# EasyEDA schematic schematic_easyeda.json
TITLE: Sheet_1; REV: 1.0; Date: 2020-01-05; Sheet: 1/1; Drawn By: andre.nho; Company: Your Company
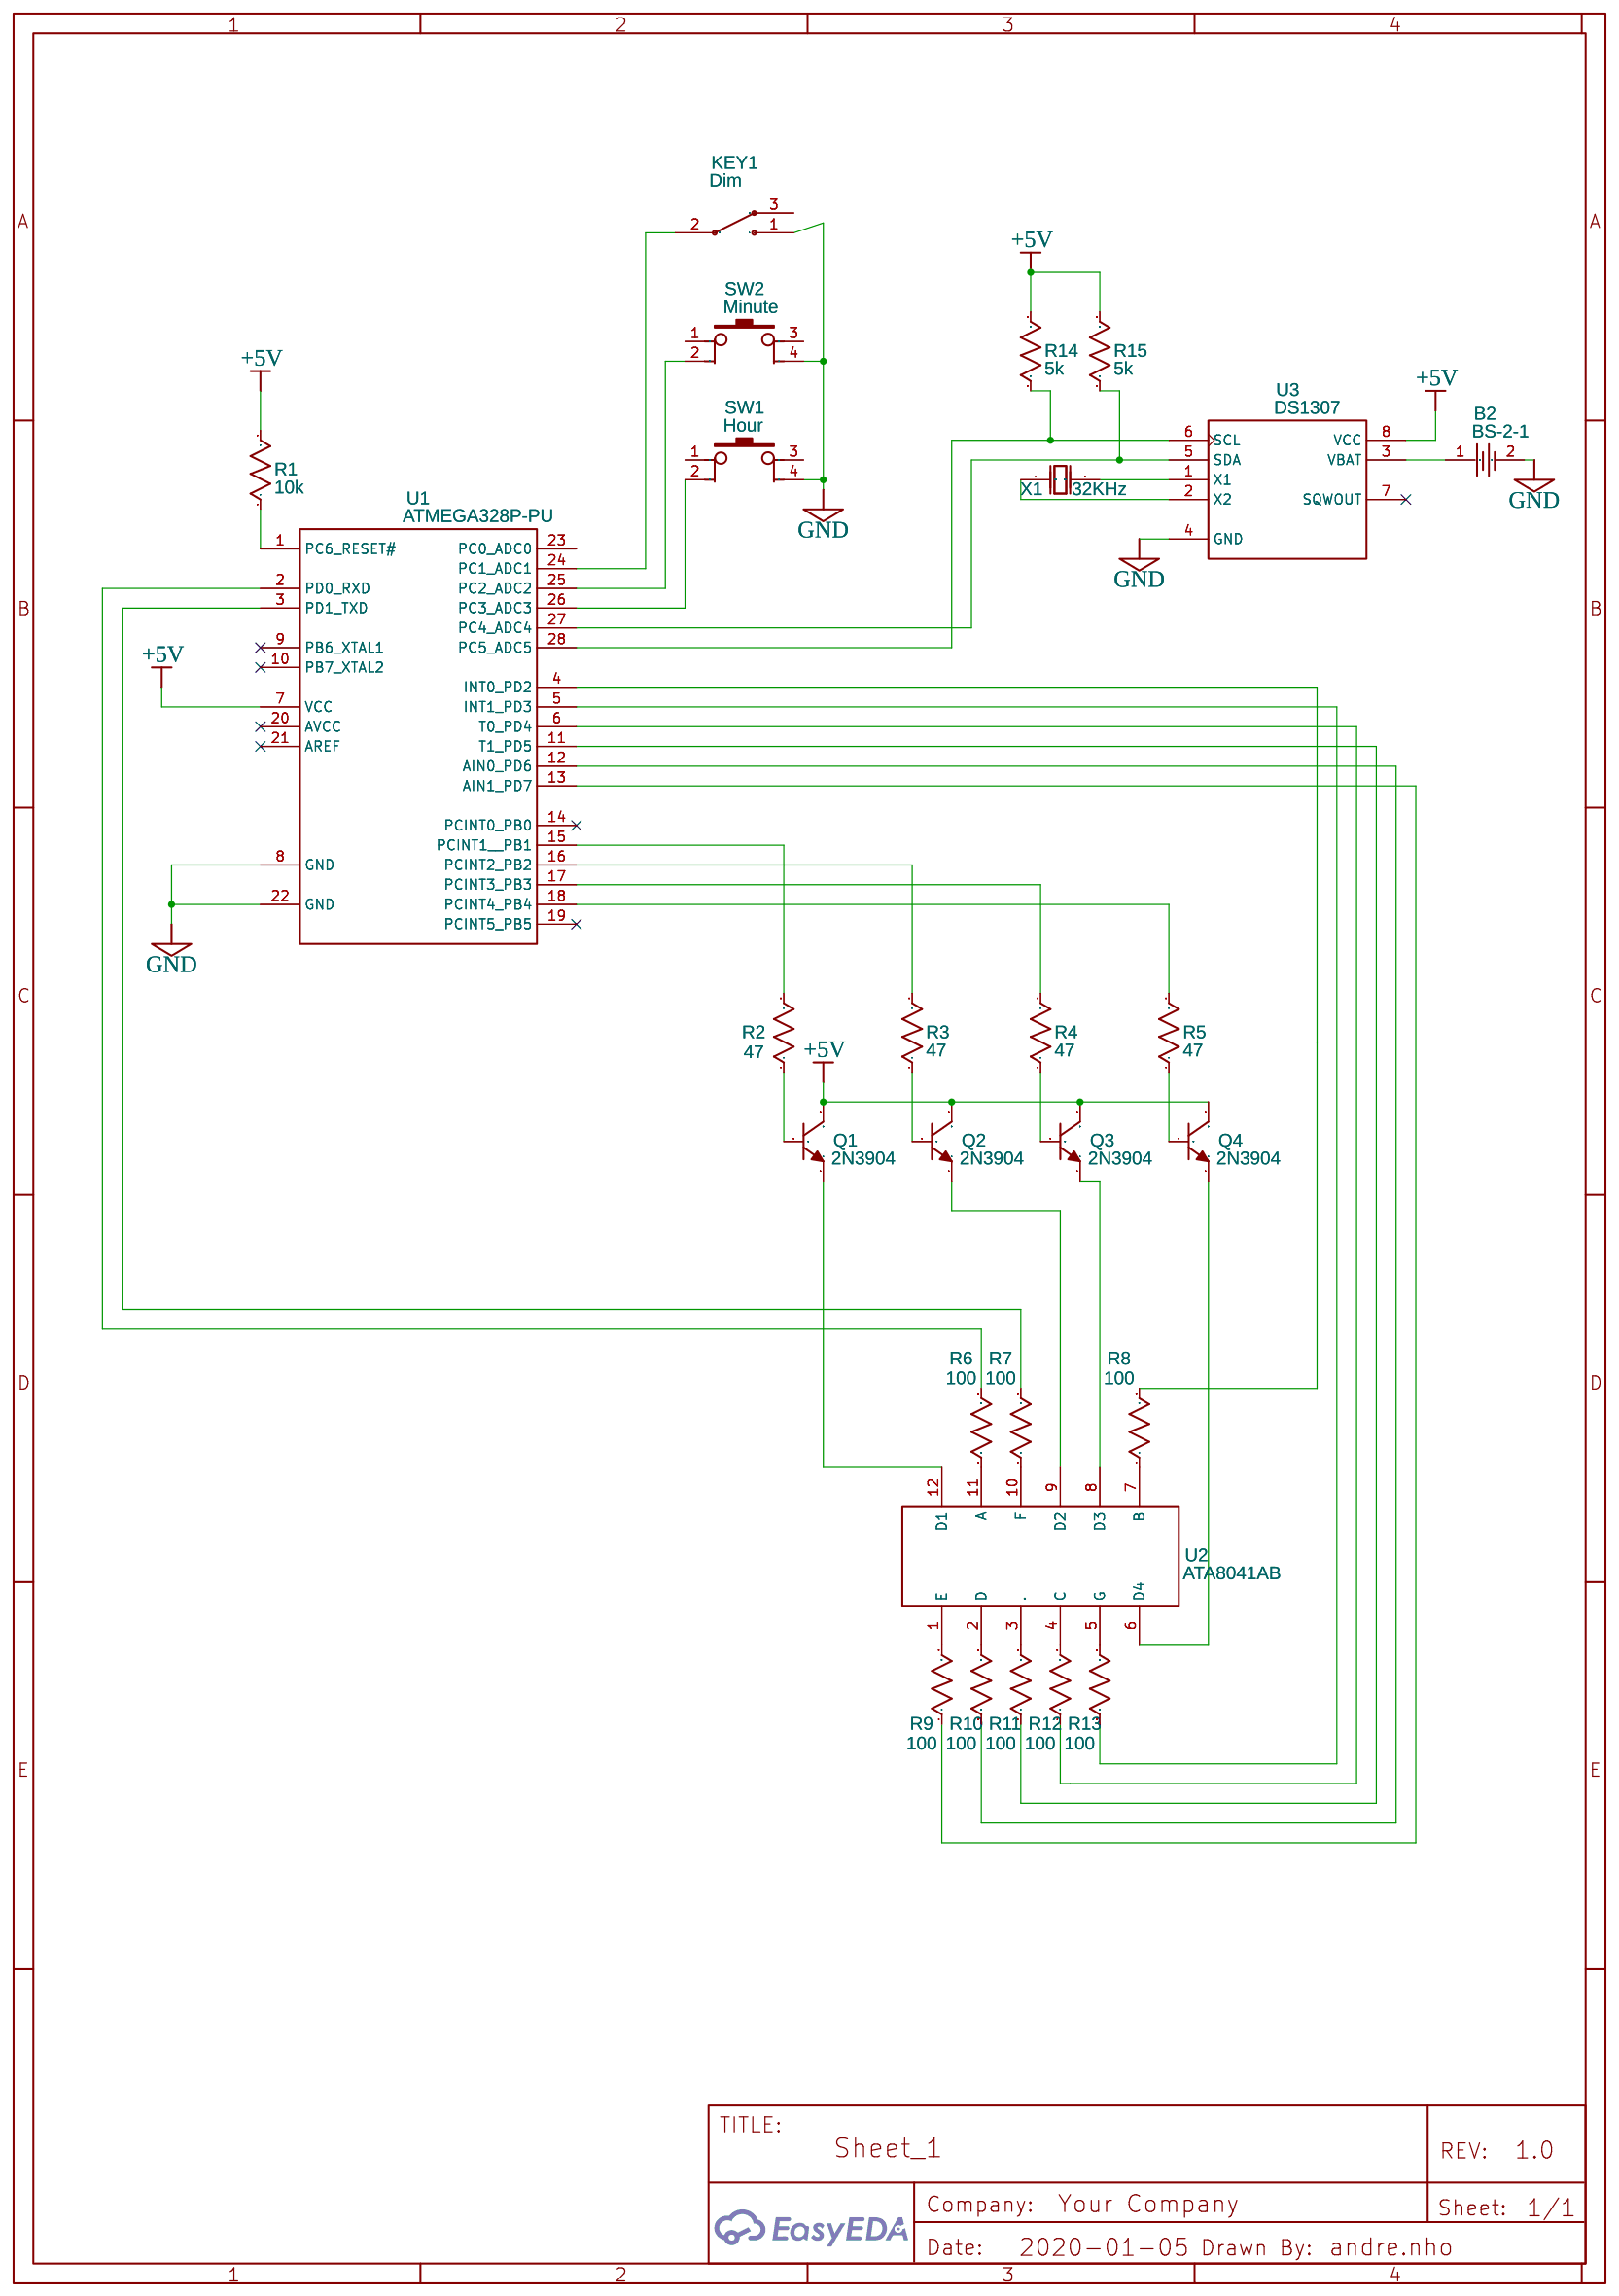
[diagram p0: schematic sheet]

## Parts
#1  -
B2  BS-2-1  [BAT-TH_BS-2-1]
KEY1  Dim  [MSK-11027]
Q1  2N3904  [TO-92(TO-92-3)]
Q2  2N3904  [TO-92(TO-92-3)]
Q3  2N3904  [TO-92(TO-92-3)]
Q4  2N3904  [TO-92(TO-92-3)]
R1  10k  [AXIAL-0.3]
R2  47  [AXIAL-0.3]
R3  47  [AXIAL-0.3]
R4  47  [AXIAL-0.3]
R5  47  [AXIAL-0.3]
R6  100  [AXIAL-0.3]
R7  100  [AXIAL-0.3]
R8  100  [AXIAL-0.3]
R9  100  [AXIAL-0.3]
R10  100  [AXIAL-0.3]
R11  100  [AXIAL-0.3]
R12  100  [AXIAL-0.3]
R13  100  [AXIAL-0.3]
R14  5k  [AXIAL-0.3]
R15  5k  [AXIAL-0.3]
SW1  Hour  [SW-SMD_4PIN-L6.00-W6.00]
SW2  Minute  [SW-SMD_4PIN-L6.00-W6.00]
U1  ATMEGA328P-PU  [DIP-28_L34.6-W7.3-P2.54-LS10.2-BL]
U2  ATA8041AB
U3  DS1307  [DIP-8]
X1  32KHz  [OSC-TH_BD2.1-P0.70-D0.3]

## Library data of the parts
#1 = -: BOM_Manufacturer Part: ?
B2 = BS-2-1: Supplier: LCSC; Manufacturer: Q&J; image: //image.lceda.cn/szlcsc/C70376.jpg; Supplier Part: C70376
KEY1 = MSK-11027 Toggle Switches: Supplier Part: C21381; Supplier: LCSC; Manufacturer: ReliaPro; image: http://image.lceda.cn/szlcsc/C21381.jpg
Q1-Q4 = 2N3904: Supplier: LCSC; Manufacturer: SEMTECH; Supplier Part: C118538
R1-R15 = Res_AXIAL-0.3(1/8W)_US
SW1 SW2 = Button-SMD-6×6×5mm: Supplier: LCSC; Manufacturer: ReliaPro; Manufacturer Part: 6×6×5mm RHOS; image: //image.lceda.cn/szlcsc/C21456.jpg; Supplier Part: C21456
U1 = ATMEGA328P-PU: sourceId: Oic6oiASL; Supplier: LCSC; Manufacturer: MICROCHIP; image: //image.lceda.cn/szlcsc/C33901.jpg; Contributor: LCSC; Supplier Part: C33901
U2 = ATA8041AB: Contributor: gregstarr2
U3 = DS1307: 64 X 8 Serial Real-Time Clock
X1 = CFV20632000AZFB: Supplier: LCSC; Supplier Part: C182052; Manufacturer: CITIZEN; Contributor: LCSC

## Nets
+5V: Q1.3(C) Q2.3(C) Q3.3(C) Q4.3(C) R1.2 R14.2 R15.2 U1.7(VCC) U3.8(VCC)
GND: B2.2 KEY1.1 SW1.4 SW2.4 U1.8(GND) U1.22(GND) U3.4(GND)
Net-(B2-1): B2.1 U3.3(VBAT)
Net-(KEY1-2): KEY1.2 U1.24(PC1 ADC1)
Net-(Q1-1): Q1.1(E) U2.12(D1)
Net-(Q1-2): Q1.2(B) R2.1
Net-(Q2-1): Q2.1(E) U2.9(D2)
Net-(Q2-2): Q2.2(B) R3.1
Net-(Q3-1): Q3.1(E) U2.8(D3)
Net-(Q3-2): Q3.2(B) R4.1
Net-(Q4-1): Q4.1(E) U2.6(D4)
Net-(Q4-2): Q4.2(B) R5.1
Net-(R1-1): R1.1 U1.1(PC6 RESET#)
Net-(R2-2): R2.2 U1.15(PCINT1  PB1)
Net-(R3-2): R3.2 U1.16(PCINT2 PB2)
Net-(R4-2): R4.2 U1.17(PCINT3 PB3)
Net-(R5-2): R5.2 U1.18(PCINT4 PB4)
Net-(R6-1): R6.1 U2.11(A)
Net-(R6-2): R6.2 U1.2(PD0 RXD)
Net-(R7-1): R7.1 U2.10(F)
Net-(R7-2): R7.2 U1.3(PD1 TXD)
Net-(R8-1): R8.1 U2.7(B)
Net-(R8-2): R8.2 U1.4(INT0 PD2)
Net-(R9-1): R9.1 U1.13(AIN1 PD7)
Net-(R9-2): R9.2 U2.1(E)
Net-(R10-1): R10.1 U1.12(AIN0 PD6)
Net-(R10-2): R10.2 U2.2(D)
Net-(R11-1): R11.1 U1.11(T1 PD5)
Net-(R11-2): R11.2 U2.3(.)
Net-(R12-1): R12.1 U1.6(T0 PD4)
Net-(R12-2): R12.2 U2.4(C)
Net-(R13-1): R13.1 U1.5(INT1 PD3)
Net-(R13-2): R13.2 U2.5(G)
Net-(R14-1): R14.1 U1.28(PC5 ADC5) U3.6(SCL)
Net-(R15-1): R15.1 U1.27(PC4 ADC4) U3.5(SDA)
Net-(SW1-2): SW1.2 U1.26(PC3 ADC3)
Net-(SW2-2): SW2.2 U1.25(PC2 ADC2)
Net-(U3-1): U3.1(X1) X1.2(OSC2)
Net-(U3-2): U3.2(X2) X1.1(OSC1)

Not connected (* = marked no-connect by the designer): KEY1 3; SW1 1 3; SW2 1 3; U1 9(PB6 XTAL1)* 10(PB7 XTAL2)* 14(PCINT0 PB0)* 19(PCINT5 PB5)* 20(AVCC)* 21(AREF)* 23(PC0 ADC0); U3 7(SQWOUT)*
